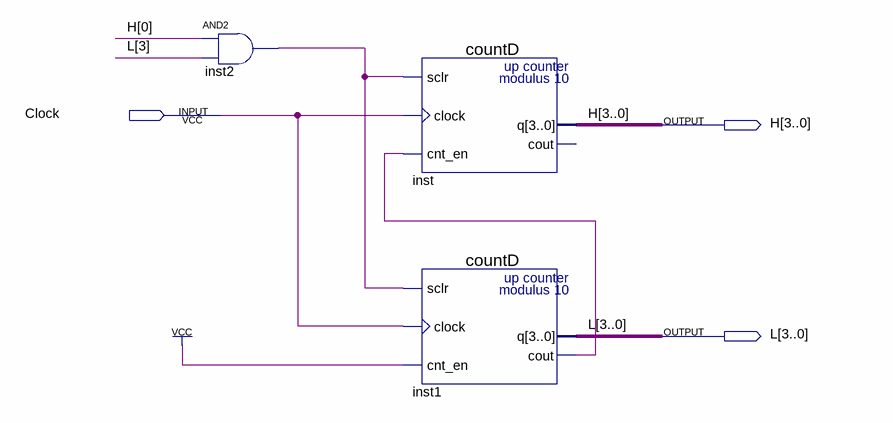
[diagram p0: schematic sheet]
// Quartus schematic cntD.bdf as structural Verilog: 3 symbols, 3 pins
module cntD (
  input  Clock,
  output [3:0] H,
  output [3:0] L
);

  wire inst1_cout, inst2_out;

  and inst2 (inst2_out, H[0], L[3]);
  countD inst (.sclr(inst2_out), .clock(Clock), .cnt_en(inst1_cout), .q(H));  // open: cout
  countD inst1 (.sclr(inst2_out), .clock(Clock), .cnt_en(1'b1), .q(L), .cout(inst1_cout));
endmodule
